# EAGLE design PS2toCoCoJoystickAtmega328POutOnly (EAGLE 7.6.0)
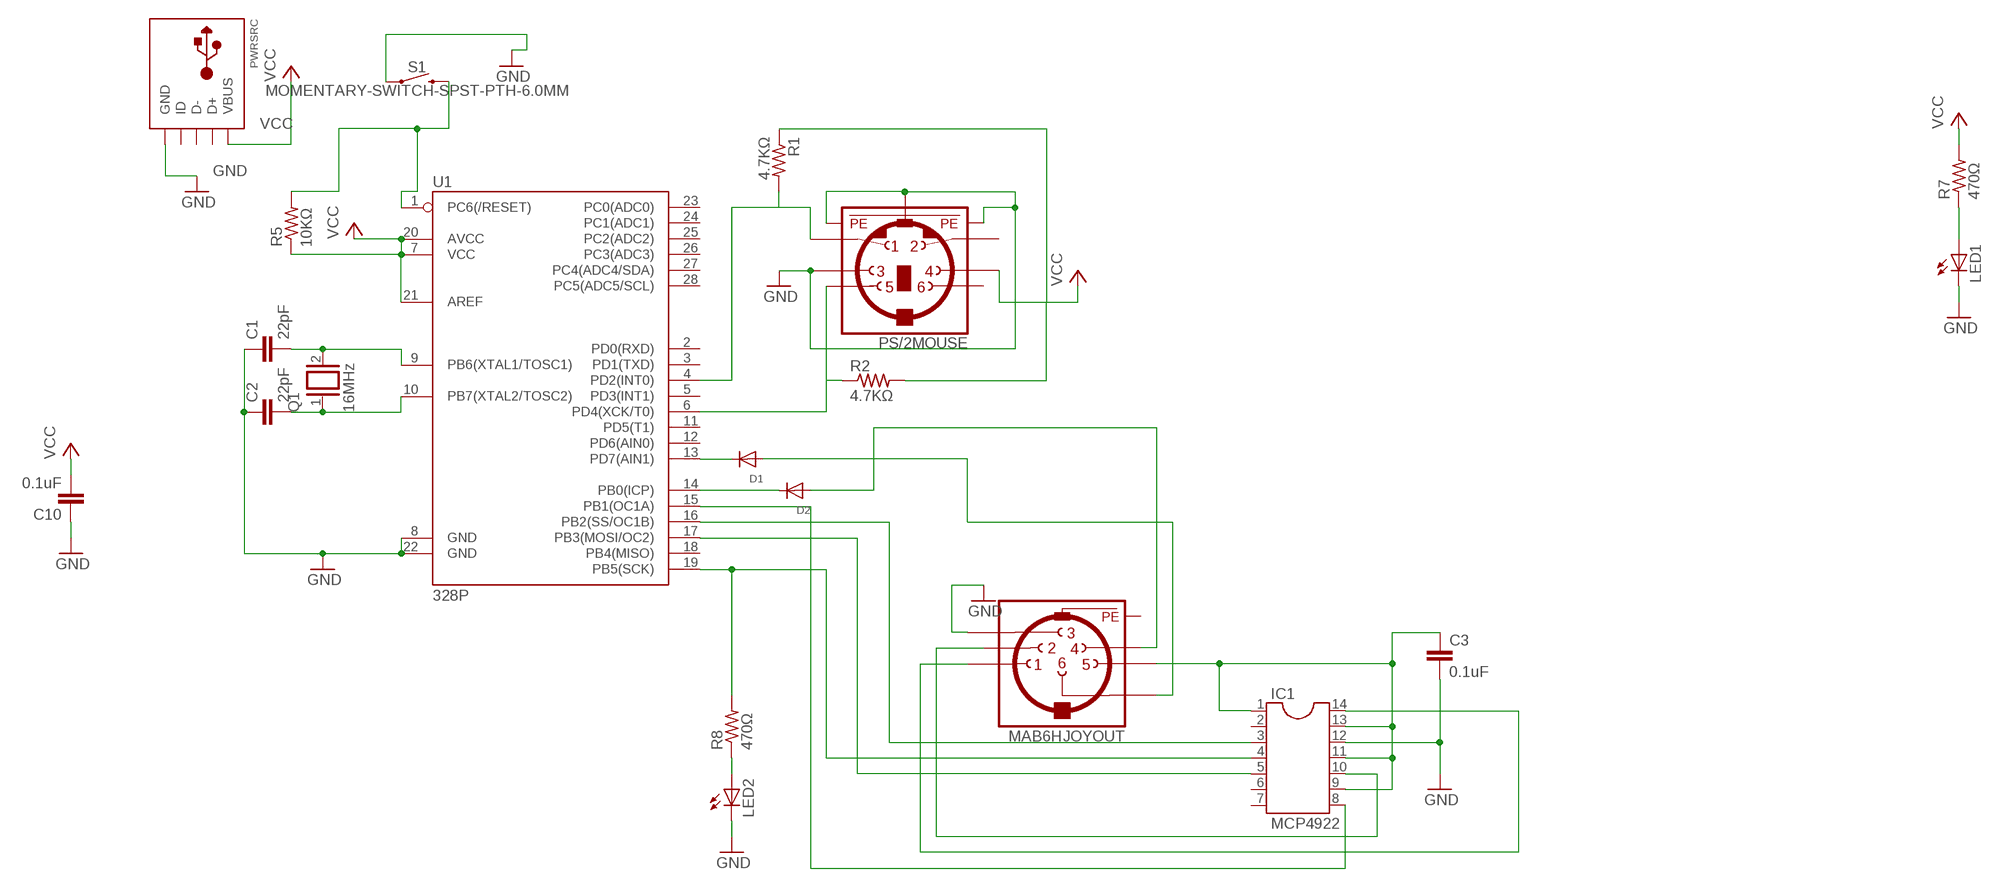
[diagram p0: schematic, sheet 1]

## Parts
C1  22pF  C2,5-3  [C2.5-3]
C2  22pF  C2,5-3  [C2.5-3]
C3  0.1uF  C5/2.5  [C5B2.5]
C10  0.1uF  C5/2.5  [C5B2.5]
D1  DIODEDO-1N4148  [DO-1N4148]
D2  DIODEDO-1N4148  [DO-1N4148]
IC1  MCP4922  DIL14  [DIL14]
JOYOUT  MAB6H  [MAB6H]
LED1  LED3MM  [LED3MM]
LED2  LED3MM  [LED3MM]
PS/2MOUSE  MINI_DIN_6  [M_DIN6]
PWRSRC  USBTHM  [USB-MINIB-THM]
Q1  16MHz  XTAL/S  [QS]
R1  4.7KΩ  R-US_0204/7  [0204/7]
R2  4.7KΩ  R-US_0204/7  [0204/7]
R5  10KΩ  R-US_0204/7  [0204/7]
R7  470Ω  R-US_0204/7  [0204/7]
R8  470Ω  R-US_0204/7  [0204/7]
S1  MOMENTARY-SWITCH-SPST-PTH-6.0MM  [TACTILE_SWITCH_PTH_6.0MM]
U1  328P  ATMEGA328P_PDIP  [DIP28]

## Nets
GND: C1.1 C2.1 C3.2 C10.1 IC1.12 JOYOUT.3 LED1.K(C) LED2.K(C) PS/2MOUSE.3 PS/2MOUSE.SH1(PE1) PS/2MOUSE.SH2(PE2) PS/2MOUSE.SH3(PE3) PWRSRC.GND S1.1 U1.8(GND) U1.22(GND)
N$1: C1.2 Q1.2 U1.9(PB6(XTAL1/TOSC1))
N$2: C2.2 Q1.1 U1.10(PB7(XTAL2/TOSC2))
N$3: R5.2 S1.3 U1.1(PC6(/RESET))
N$4: D2.A JOYOUT.4
N$5: D1.C U1.13(PD7(AIN1))
N$6: D2.C U1.14(PB0(ICP))
N$7: C3.1 IC1.1 IC1.9 IC1.11 IC1.13 JOYOUT.5
N$8: IC1.3 U1.16(PB2(SS/OC1B))
N$12: D1.A JOYOUT.6
N$13: IC1.10 JOYOUT.2
N$14: IC1.14 JOYOUT.1
N$18: PS/2MOUSE.1 R1.2 U1.4(PD2(INT0))
N$19: PS/2MOUSE.6 R2.1 U1.6(PD4(XCK/T0))
N$20: IC1.8 U1.15(PB1(OC1A))
N$22: IC1.4 R8.2 U1.19(PB5(SCK))
N$23: IC1.5 U1.17(PB3(MOSI/OC2))
N$27: LED1.A R7.1
N$29: LED2.A R8.1
VCC: C10.2 PS/2MOUSE.5 PWRSRC.VBUS R1.1 R2.2 R5.1 R7.2 U1.7(VCC) U1.20(AVCC) U1.21(AREF)
Unconnected: IC1.2 IC1.6 IC1.7 PS/2MOUSE.2 PS/2MOUSE.8 PWRSRC.D+ PWRSRC.D- PWRSRC.ID U1.2(PD0(RXD)) U1.3(PD1(TXD)) U1.5(PD3(INT1)) U1.11(PD5(T1)) U1.12(PD6(AIN0)) U1.18(PB4(MISO)) U1.23(PC0(ADC0)) U1.24(PC1(ADC1)) U1.25(PC2(ADC2)) U1.26(PC3(ADC3)) U1.27(PC4(ADC4/SDA)) U1.28(PC5(ADC5/SCL))

## Power pins joined to a net without a drawn wire
GND: JOYOUT.PE JOYOUT.PE@(PE)

## Library data of the parts
C1-C3 C10 = capacitor-wima:C: CAPACITOR naming: grid - package width
D1 D2 = adafruit:DIODE: Diode SMADIODE - SMA Surface Mount Package 20V 1A Schottky Diode Digikey: 641-1014-6-ND DO-1N4148 - Through Hole Small Current Diode SOD-123 20V 1 A (.5mV Vf) Schottky Diode - Digikey: MBRX120TPMSCT-ND SOD-323 10V 570mA (.38mV Vf, 3ns) Schottky Diode - Digikey: ZLLS410CT-ND SOD-523 30V 30mA Schottky Diode (RB751S-40TE61) - Digikey: RB751S-40TE61CT-ND SOT23-R/W - SOT23 Package (R = Solder Paste/Reflow Ovens, W = Hand-Soldering) BAT54Film 40V 300mA - Digikey: 497-7162-1-ND
IC1 = ic-package:DIL14: Dual In Line / Socket
JOYOUT = con-hirschmann:MAB6H: Female CONNECTOR 6 pins with shield, horizontal (DIN 45322); MF: FARNELL; MPN: MAB 6 H; OC_FARNELL: 809901; OC_NEWARK: 67C7887
LED1 = led:LED: LED
LED2 = adafruit@1:LED: LED
PS/2MOUSE = mini_din:MINI_DIN_6
PWRSRC = adafruit:USB: USB Connectors USBMINIB - Surface Mount Female Mini-B USB Connector 4UConnector: 06564 By microbuilder.eu Thru-hole RA Female Mini-B USB Connector 4UConnector: 18732 By ladyada.net
Q1 = special:XTAL/S: CRYSTAL
R1 R2 R5 R7 R8 = adafruit_myupdate:R-US_: RESISTOR, American symbol
S1 = SparkFun-Switches:MOMENTARY-SWITCH-SPST: Momentary Switch (Pushbutton) - SPST Normally-open (NO) SPST momentary switches (buttons, pushbuttons). Variants PTH-12MM - 12mm square, through-hole Momentary Pushbutton Switch - 12mm Square <https://www.sparkfun.com/products/9190> (COM-09190) PTH-6.0MM, PTH-6.0MM-KIT - 6.0mm square, through-hole Mini Pushbutton Switch <https://www.sparkfun.com/products/97> (COM-00097) KIT package intended for soldering kit's - only one side of pads' copper is exposed. PTH-RIGHT-ANGLE-KIT - Right-angle, through-hole Right Angle Tactile Button <https://www.sparkfun.com/products/10791> - Used on SparkFun BigTime Watch Kit <https://www.sparkfun.com/products/11734> SMD-12MM - 12mm square, surface-mount Tactile Button - SMD (12mm) <https://www.sparkfun.com/products/12993> (COM-12993) Used on SparkFun PicoBoard <https://www.sparkfun.com/products/11888> SMD-4.5MM - 4.5mm Square Trackball Switch Used on SparkFun Blackberry Trackballer Breakout <https://www.sparkfun.com/products/13169> SMD-4.6MMX2.8MM - 4.60mm x 2.80mm, surface mount Used on SparkFun SAMD21 Mini Breakout <https://www.sparkfun.com/products/13664> SMD-5.2MM, SMD-5.2-REDUNDANT - 5.2mm square, surface-mount Mini Pushbutton Switch - SMD <https://www.sparkfun.com/products/8720> (COM-08720) Used on Arduino Pro Mini <https://www.sparkfun.com/products/11114> REDUNDANT package connects both switch circuits together SMD-6.0X3.5MM - 6.0 x 3.5mm, surface mount Momentary Reset Switch SMD <https://www.sparkfun.com/products/8229> (COM-08229) SMD-6.2MM-TALL - 6.2mm square, surface mount Tactile Button - SMD (6mm) <https://www.sparkfun.com/products/12992> Used on SparkFun Digital Sandbox <https://www.sparkfun.com/products/12651> SMD-RIGHT-ANGLE - Right-angle, surface mount Used on SparkFun Block for Intel® Edison - Arduino <https://www.sparkfun.com/products/13036>; PROD_ID: SWCH-08441; SF_SKU: COM-00097
U1 = SparkFun-IC-Microcontroller:ATMEGA328P_PDIP: Atmel 328P Through hole ATMEGA328P uC used in the Arduino 32kb flash, 1k EEPROM, 2k SRAM Datasheet <http://www.sparkfun.com/datasheets/Components/SMD/ATMega328.pdf> SparkFun Products Storefront component: AVR 28 Pin 20MHz 32K 6A/D - ATMega328P <https://www.sparkfun.com/products/9061> (COM-09061) SparkFun Simon Says - Through-Hole Soldering Kit <https://www.sparkfun.com/products/10547> (KIT-10547) SparkFun Learn to Solder - Simon Says <https://www.sparkfun.com/products/13708> (KIT-13708) SparkFun BigTime Watch Kit <https://www.sparkfun.com/products/11734> (KIT-11734) SparkFun ClockIt <https://www.sparkfun.com/products/10930> (KIT-10930) SparkFun Serial Enabled LCD Kit <https://www.sparkfun.com/products/10097> (LCD-10097) SparkFun Simon Tilts - Through Hole Soldering Kit <https://www.sparkfun.com/products/12634> (KIT-12634) SparkFun Frequency Counter Kit <https://www.sparkfun.com/products/10140> (KIT-10140) FabFM Radio Kit <https://www.sparkfun.com/products/11043> (KIT-11043) SparkFun Binary Blaster Kit <https://www.sparkfun.com/products/12037> (KIT-12037) SparkFun Metro-Gnome <https://www.sparkfun.com/products/9236> (KIT-09236) ATmega328 with Arduino Optiboot (Uno) <https://www.sparkfun.com/products/10524> (DEV-10524); PROD_ID: IC-09136

## Board
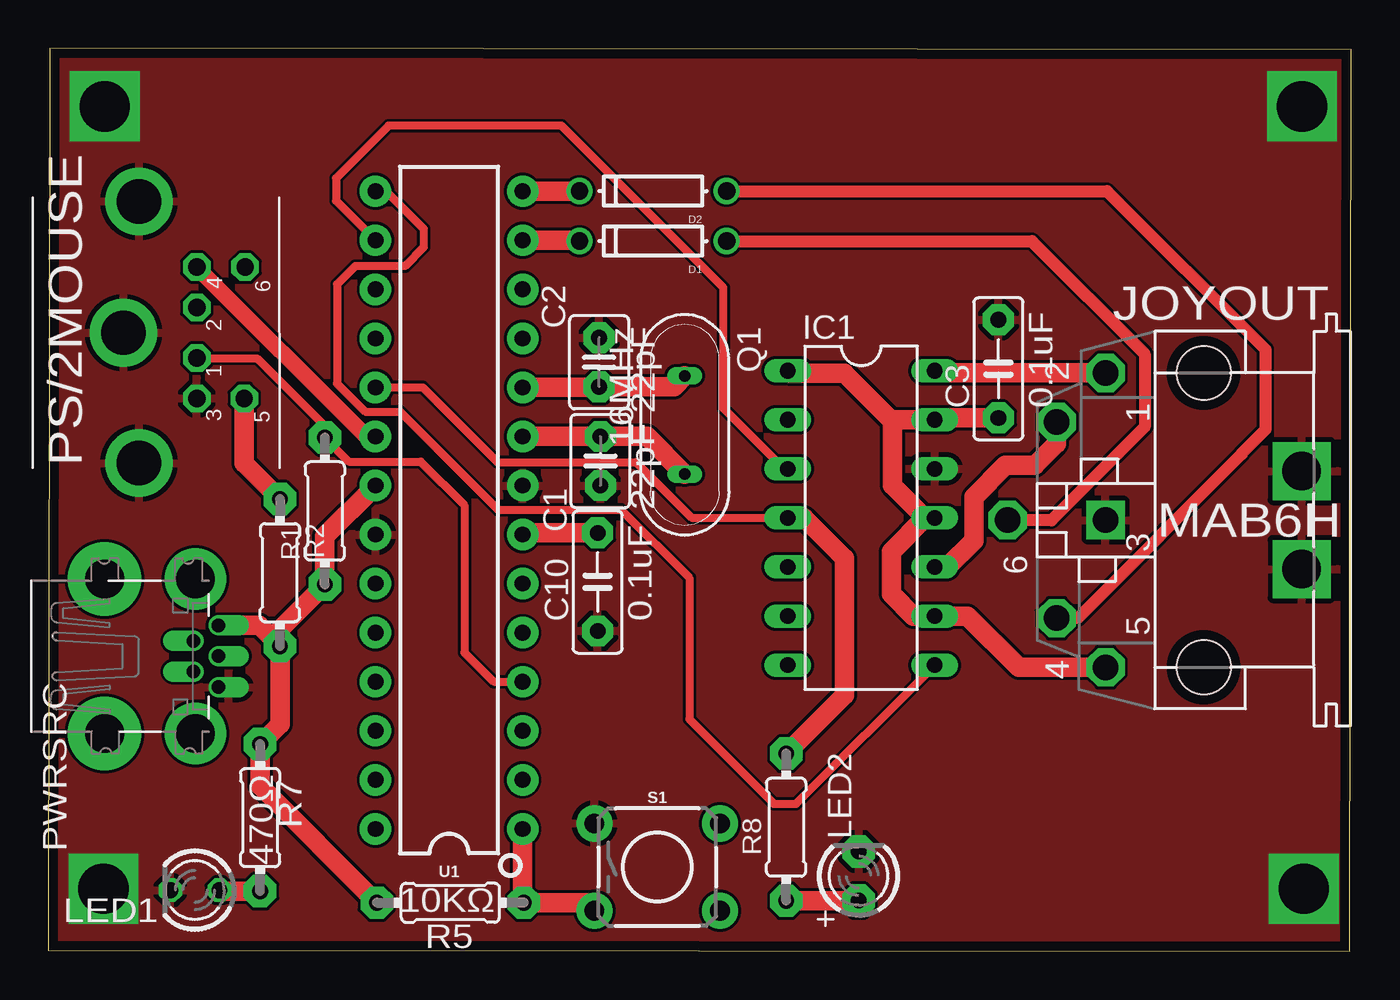
[diagram p1: board, top side]
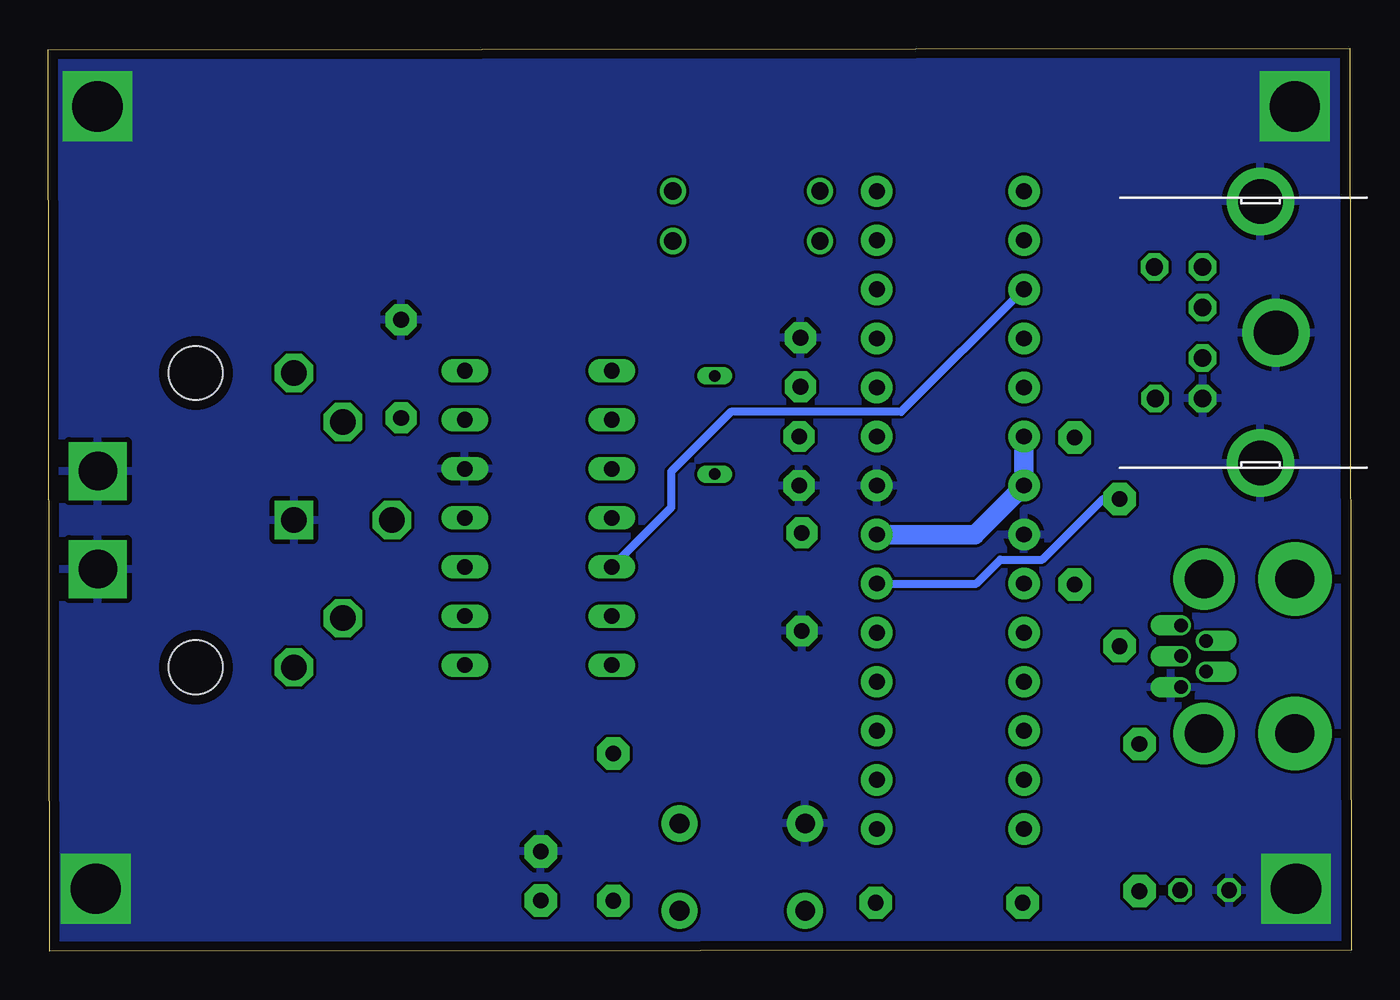
[diagram p2: board, bottom side, seen from below]

Size 67.5 x 46.76 mm. Coordinates in mm from the lower left corner, seen from the top.
Outline: 0,0.06 67.44,0 67.5,46.7 0.06,46.76 0,0.06
Copper layers (1*16): Top 0.035mm / dielectric 1.6mm / Bottom 0.035mm
Design rules "Elecrow_2-layer_PCB_eagle_rule": minimum track width 6mil, minimum drill 12mil, track to track 6mil, track to pad 6mil, pad to pad 6mil, via to via 8mil, smd to smd 0mil, copper to edge 20mil, drill to drill 10mil, minimum pad ring 6mil, minimum via ring 6mil, stop-mask expansion 0mil, vias tented up to drill 100mil, thermal gap 10mil

### Footprints (pad centres in the part's own frame; a part is rotated, then mirrored left to right if it is on the bottom)
C2.5-3 = drill 0.813 pad 1.6 octagon: 1 -1.27,0; 2 1.27,0
C5B2.5 = drill 0.813 pad 1.6 octagon: 1 -2.54,0; 2 2.54,0
DO-1N4148 = drill 0.9: A -3.81,0; C 3.81,0
DIL14 = drill 0.813 long: 1 -7.62,-3.81; 2 -5.08,-3.81; 3 -2.54,-3.81; 4 0,-3.81; 5 2.54,-3.81; 6 5.08,-3.81; 7 7.62,-3.81; 8 7.62,3.81; 9 5.08,3.81; 10 2.54,3.81; 11 0,3.81; 12 -2.54,3.81; 13 -5.08,3.81; 14 -7.62,3.81
MAB6H = drill 1.321 octagon: 1 7.62,5.08; 2 5.08,7.62; 4 -5.08,7.62; 5 -7.62,5.08; 6 0,10.16 | drill 1.321 square: 3 0,5.08 | drill 2 square: PE -2.54,-5.08; PE@ 2.54,-5.08 | hole 2.794: 7.62,0; -7.62,0
LED3MM = drill 0.813 octagon: A -1.27,0; K 1.27,0
LED3MM' = drill 0.813 pad 1.676 octagon: A -1.27,0; K 1.27,0
M_DIN6 = drill 0.9 pad 1.422 octagon: 1 -1.3,-3.75; 2 1.3,-3.75; 3 -3.4,-3.75; 5 3.4,-3.75; 6 -3.4,-6.2; 8 3.4,-6.25 | drill 2.3 pad 3.5: SH1 6.8,-0.75; SH2 0,0.05; SH3 -6.75,-0.75
USB-MINIB-THM = drill 0.7 offset: D+ 0,9.8; D- -0.8,8.5; GND 1.6,9.8; ID 0.8,8.5; VBUS -1.6,9.8 | drill 2 pad 3.81: GND1 -4,3.9; GND4 4,3.9 | drill 2 pad 3.2: GND2 -4,8.6; GND3 4,8.6
QS = drill 0.61 long: 1 -2.54,0; 2 2.54,0
0204/7 = drill 0.813 pad 1.676 octagon: 1 -3.81,0; 2 3.81,0
TACTILE_SWITCH_PTH_6.0MM = drill 1.016 pad 1.88: 1 -3.251,2.261; 2 3.251,2.261; 3 -3.251,-2.261; 4 3.251,-2.261
DIP28 = drill 0.813 pad 1.626: 1 -16.51,-3.81; 2 -13.97,-3.81; 3 -11.43,-3.81; 4 -8.89,-3.81; 5 -6.35,-3.81; 6 -3.81,-3.81; 7 -1.27,-3.81; 8 1.27,-3.81; 9 3.81,-3.81; 10 6.35,-3.81; 11 8.89,-3.81; 12 11.43,-3.81; 13 13.97,-3.81; 14 16.51,-3.81; 15 16.51,3.81; 16 13.97,3.81; 17 11.43,3.81; 18 8.89,3.81; 19 6.35,3.81; 20 3.81,3.81; 21 1.27,3.81; 22 -1.27,3.81; 23 -3.81,3.81; 24 -6.35,3.81; 25 -8.89,3.81; 26 -11.43,3.81; 27 -13.97,3.81; 28 -16.51,3.81

### Placement (x,y rotation side)
C1  28.6,25.39 90 top
C2  28.54,30.51 270 top
C3  49.23,30.16 90 top
C10  28.46,19.13 90 top
D1  31.33,36.78 180 top
D2  31.33,39.37 180 top
IC1  42.11,22.44 270 top
JOYOUT  59.86,22.33 90 top
LED1  7.59,3.16 180 top
LED2  [LED3MM']  41.99,3.9 90 top
PS/2MOUSE  3.95,32.03 90 top
PWRSRC  -0.98,15.28 270 top
Q1  32.97,27.25 270 top
R1  14.33,22.8 90 top
R2  12,19.61 270 top
R5  20.83,2.51 0 top
R7  10.97,6.92 90 top
R8  38.23,6.43 90 top
S1  31.55,4.36 0 top
U1  20.76,22.85 90 top

### Tracks (layer width: path | path; a pad name or v marks a point on that pad's centre or on a via)
GND  (via drill 2.6)
  other vias: 2.92,43.75 2.86,3.24 65.05,3.24 64.95,43.75
  pour Bottom: 0,0.06 68.48,0.32 68.54,46.86 0.06,46.61
  pour Top: -0.34,0.06 68.14,0.32 68.2,46.86 -0.28,46.61
N$1
  Top 1.016: U1.9 C1.2 31.03,26.66 Q1.2
N$2
  Top 1.016: U1.10 28.5,29.2 C2.2 32.41,29.24 Q1.1
N$3
  Top 1.016: U1.1 24.57,2.58 R5.2 27.88,2.51 S1.3
N$4
  Top 0.61: D2.A 54.85,39.37 63.06,31.17 63.06,27.01 61.84,25.79 61.84,25.76 53.33,17.25 JOYOUT.4
  Top 1.016: 52.25,17.26 JOYOUT.4
N$5
  Top 1.016: U1.13 27.48,36.82 D1.C
N$6
  Top 1.016: U1.14 27.51,39.36 D2.C
N$7
  Top 1.016: C3.1 46.02,27.62 IC1.13 43.65,27.52 | 43.65,27.52 41.24,29.93 38.43,29.93 IC1.1 | JOYOUT.5 50.28,14.71 47.62,17.36 IC1.9 44.82,17.36 43.67,18.5 43.67,20.7 45.41,22.44 IC1.11 45.43,22.44 43.74,24.13 43.74,27.43 43.65,27.52
N$8
  Top 0.406: IC1.3 38.11,24.98 34.98,28.12 34.98,34.37 26.58,42.76 17.63,42.76 14.91,40.04 14.91,38.86 U1.16
N$12
  Top 0.61: D1.A 50.97,36.78 56.81,30.94 56.81,27.15 51.97,22.31 JOYOUT.6
  Top 1.016: JOYOUT.6
N$13
  Top 1.016: IC1.10 46.58,19.9 47.94,21.26 47.94,23.51 49.59,25.16 51.12,25.16 52.23,26.28 JOYOUT.2
N$14
  Top 1.016: JOYOUT.1 46.04,29.95 IC1.14
N$18
  Top 0.406: PS/2MOUSE.1 7.72,30.71 10.82,30.71 14.33,27.2 R1.2 15.57,25.36 19.29,25.36 21.57,23.09 21.57,15.47 23.08,13.96 U1.4
N$19
  Top 1.016: PS/2MOUSE.6 10.15,25.27 R2.1
  Bottom 0.406: U1.6 19.43,19.04 18.19,20.28 16,20.28 12.87,23.42 R2.1
N$20
  Top 0.406: U1.15 17.51,39.36 19.46,37.41 19.46,36.46 18.48,35.48 15.9,35.48 14.96,34.54 14.96,29.4 16.42,27.94 18.22,27.94 23.3,22.86 29.68,22.86 33.21,19.33 33.21,12.01 37.59,7.63 38.73,7.63 IC1.8
N$22
  Top 0.406: U1.19 19.39,29.2 23.27,25.32 30.45,25.32 33.33,22.45 IC1.4
  Top 1.016: R8.2 41.24,13.25 41.24,20.35 39.14,22.44 IC1.4
N$23
  Bottom 0.406: U1.17 16.97,34.28 23.32,27.93 32.14,27.93 35.23,24.84 35.23,22.97 IC1.5
N$27
  Top 1.016: R7.1 8.91,3.11 LED1.A
N$29
  Top 1.016: R8.1 41.97,2.62 LED2.A
VCC
  Top 0.61: 24.52,21.63 U1.7 24.66,21.67
  Top 0.813: U1.20 16.47,26.66 PS/2MOUSE.5
  Top 1.016: PWRSRC.VBUS 10.92,16.88 R2.2 | R2.2 12,16.66 R1.1 14.33,21.49 U1.21 | R2.2 12,11.76 R7.2 10.97,8.56 R5.1 | C10.2 24.66,21.67
  Bottom 1.016: U1.7 19.49,21.58 U1.21 U1.20